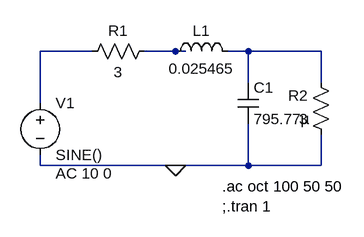
[diagram p0: schematic EXPT 1B.asc]
EXPT 1B.asc, the LTspice schematic file:
Version 4
SHEET 1 880 680
WIRE 16 64 -64 64
WIRE 144 64 96 64
WIRE 160 64 144 64
WIRE 256 64 224 64
WIRE 368 64 256 64
WIRE 256 112 256 64
WIRE 368 112 368 64
WIRE -64 144 -64 64
WIRE -64 240 -64 224
WIRE 144 240 -64 240
WIRE 256 240 256 176
WIRE 256 240 144 240
WIRE 368 240 368 192
WIRE 368 240 256 240
FLAG 144 240 0
SYMBOL voltage -64 128 R0
WINDOW 123 24 124 Left 2
WINDOW 39 0 0 Left 0
SYMATTR InstName V1
SYMATTR Value SINE()
SYMATTR Value2 AC 10 0
SYMBOL res 112 48 R90
WINDOW 0 0 56 VBottom 2
WINDOW 3 32 56 VTop 2
SYMATTR InstName R1
SYMATTR Value 3
SYMBOL res 384 208 R180
WINDOW 0 36 76 Left 2
WINDOW 3 36 40 Left 2
SYMATTR InstName R2
SYMATTR Value 3
SYMBOL ind 128 80 R270
WINDOW 0 32 56 VTop 2
WINDOW 3 5 56 VBottom 2
SYMATTR InstName L1
SYMATTR Value 0.025465
SYMBOL cap 240 112 R0
SYMATTR InstName C1
SYMATTR Value 795.77µ
TEXT 216 272 Left 2 !.ac oct 100 50 50\n;.tran 1

The netlist it stands for:
* EXPT 1B.asc
V1 N001 0 SINE() AC 10 0
R1 N002 N001 3
R2 0 N003 3
L1 N002 N003 0.025465
C1 N003 0 795.77µ
.ac oct 100 50 50
;.tran 1
.backanno
.end